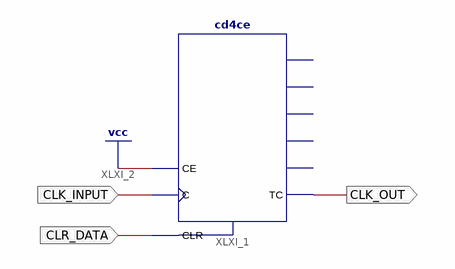
[diagram p0: schematic sheet 1]
// Xilinx ISE schematic TEN_DIV.sch (spartan6) as structural Verilog: 1 symbols, 3 ports
module TEN_DIV (
  input  CLK_INPUT,
  input  CLR_DATA,
  output CLK_OUT
);

  cd4ce XLXI_1 (.C(CLK_INPUT), .CE(1'b1), .CLR(CLR_DATA), .TC(CLK_OUT));  // open: CEO, Q0, Q1, Q2, Q3
endmodule
